# EAGLE schematic cc1200layout (EAGLE 6.4)
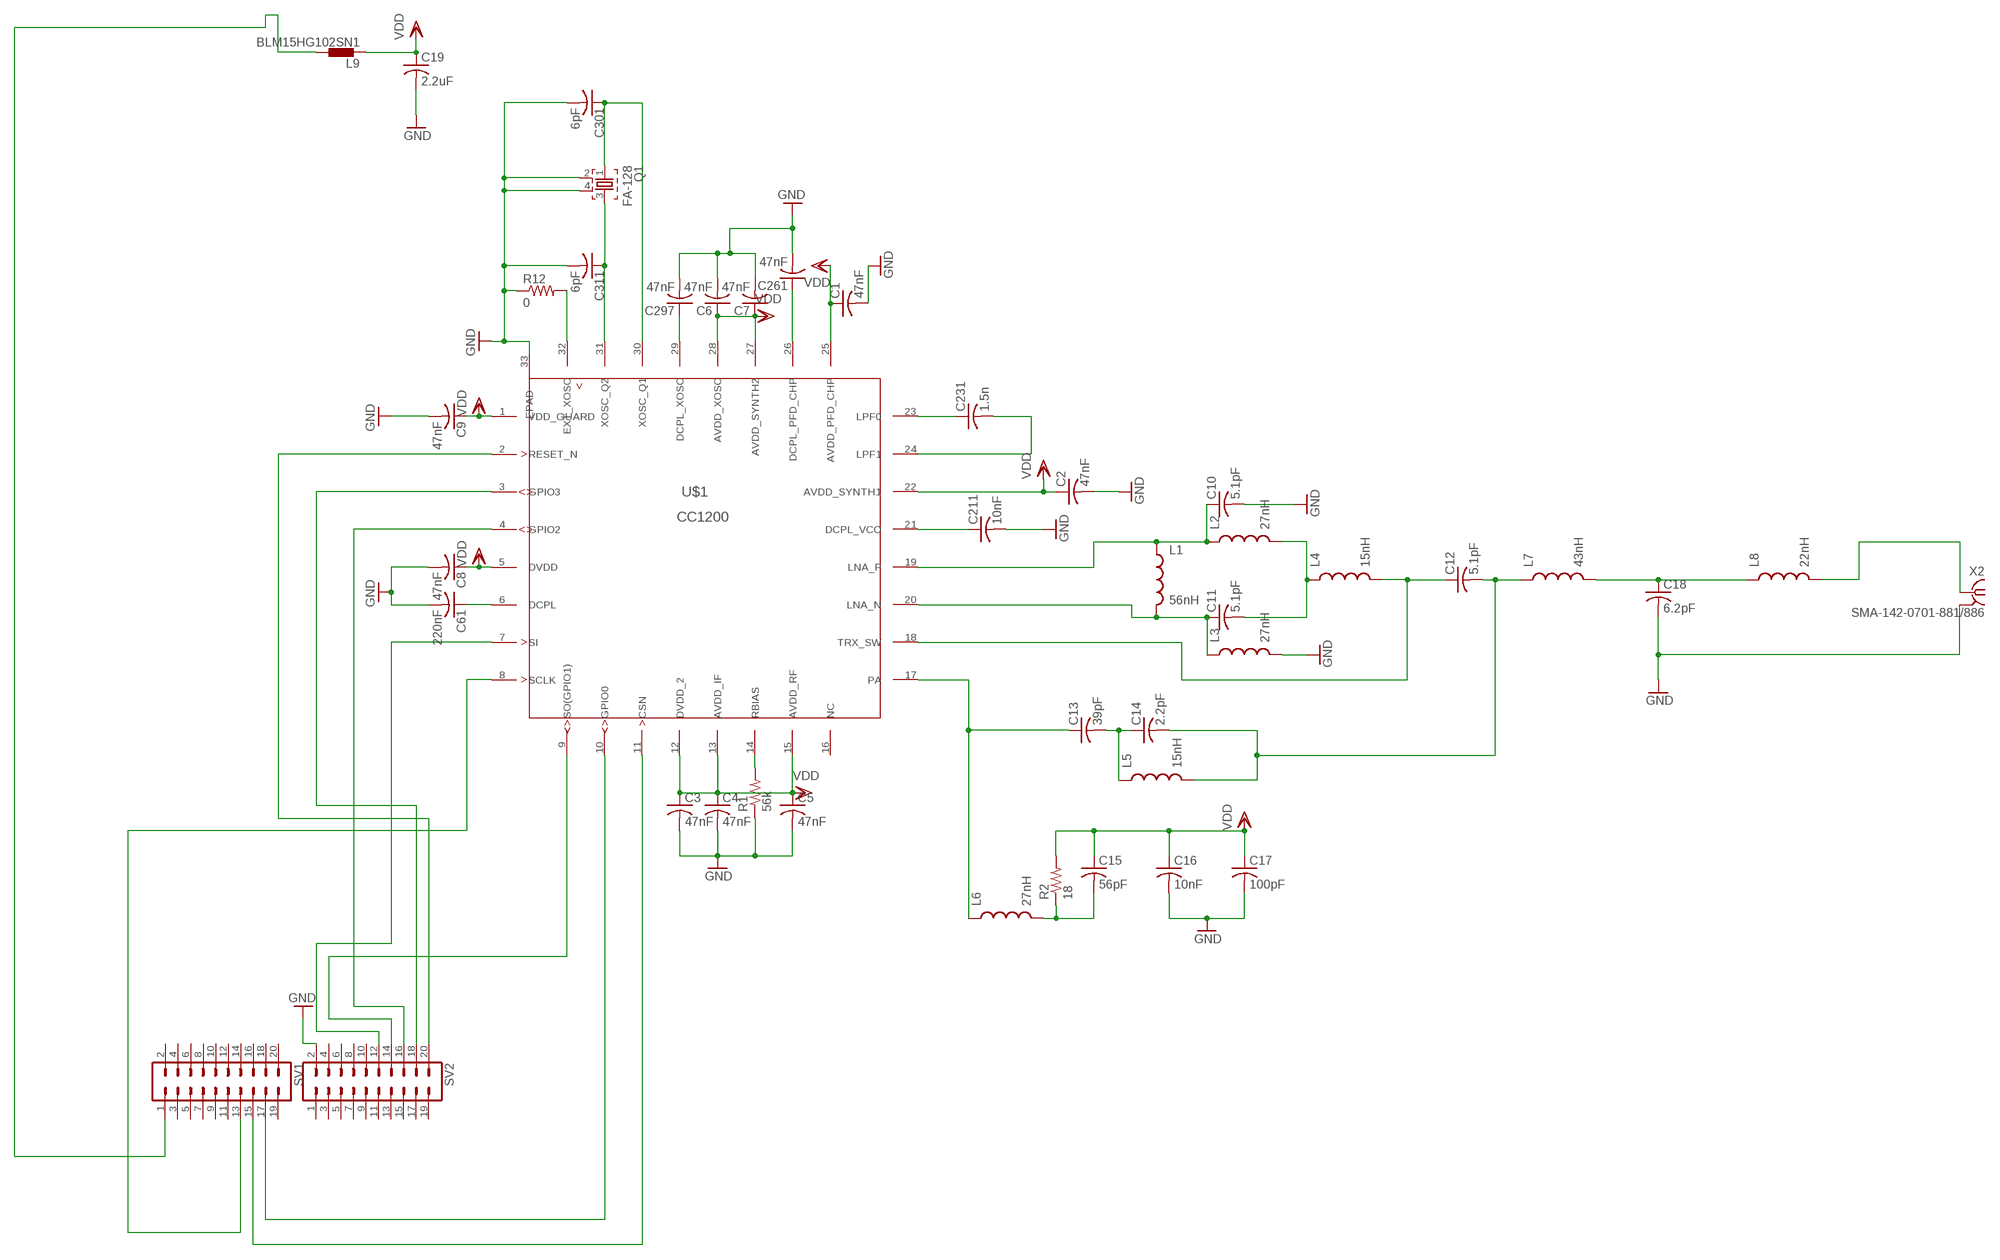
[diagram p0: schematic, sheet 1]

## Parts
C1  47nF  C-USC0402K  [C0402K]
C2  47nF  C-USC0402K  [C0402K]
C3  47nF  C-USC0402K  [C0402K]
C4  47nF  C-USC0402K  [C0402K]
C5  47nF  C-USC0402K  [C0402K]
C6  47nF  C-USC0402K  [C0402K]
C7  47nF  C-USC0402K  [C0402K]
C8  47nF  C-USC0402K  [C0402K]
C9  47nF  C-USC0402K  [C0402K]
C10  5.1pF  C-USC0402K  [C0402K]
C11  5.1pF  C-USC0402K  [C0402K]
C12  5.1pF  C-USC0402K  [C0402K]
C13  39pF  C-USC0402K  [C0402K]
C14  2.2pF  C-USC0402K  [C0402K]
C15  56pF  C-USC0402K  [C0402K]
C16  10nF  C-USC0402K  [C0402K]
C17  100pF  C-USC0402K  [C0402K]
C18  6.2pF  C-USC0402K  [C0402K]
C19  2.2uF  C-USC0603K  [C0603K]
C61  220nF  C-USC0402K  [C0402K]
C211  10nF  C-USC0402K  [C0402K]
C231  1.5n  C-USC0402K  [C0402K]
C261  47nF  C-USC0402K  [C0402K]
C297  47nF  C-USC0402K  [C0402K]
C301  6pF  C-USC0402K  [C0402K]
C311  6pF  C-USC0402K  [C0402K]
L1  56nH  INDUCTOR0402  [C0402]
L2  27nH  INDUCTOR0402  [C0402]
L3  27nH  INDUCTOR0402  [C0402]
L4  15nH  INDUCTOR0402  [C0402]
L5  15nH  INDUCTOR0402  [C0402]
L6  27nH  INDUCTOR0402  [C0402]
L7  43nH  INDUCTOR0402  [C0402]
L8  22nH  INDUCTOR0402  [C0402]
L9  BLM15HG102SN1  [0402]
Q1  FA-128  [FA-128]
R1  56k  R-US_R0402  [R0402]
R2  18  R-US_R0402  [R0402]
R12  0  R-US_R0402  [R0402]
SV1  MA10-2  [MA10-2]
SV2  MA10-2  [MA10-2]
U$1  CC1200  [RHB32_3P45X3P45]
X2  SMA-142-0701-881/886  [J502-ND-142-0701-881/886]

## Nets
GND: C1.2 C2.2 C3.2 C4.2 C5.2 C6.2 C7.2 C8.2 C9.2 C10.2 C16.2 C17.2 C18.2 C19.2 C61.2 C211.2 C261.2 C297.2 C301.2 C311.2 L3.2 Q1.2 Q1.4 R1.1 R12.1 SV2.2 U$1.33(EPAD) X2.G@1 X2.G@2 X2.G@3 X2.G@4
N$1: SV2.12 U$1.7(SI)
N$2: SV1.13 U$1.8(SCLK)
N$3: SV2.14 U$1.9(SO(GPIO1))
N$4: SV1.17 U$1.10(GPIO0)
N$5: SV1.15 U$1.11(CSN)
N$6: C231.1 U$1.23(LPF0)
N$7: C231.2 U$1.24(LPF1)
N$8: C211.1 U$1.21(DCPL_VCO)
N$9: C261.1 U$1.26(DCPL_PFD_CHP)
N$10: C297.1 U$1.29(DCPL_XOSC)
N$11: C61.1 U$1.6(DCPL)
N$12: R1.2 U$1.14(RBIAS)
N$13: R12.2 U$1.32(EXT_XOSC)
N$14: C311.1 Q1.3 U$1.31(XOSC_Q2)
N$15: SV2.16 U$1.4(GPIO2)
N$16: SV2.18 U$1.3(GPIO3)
N$17: SV2.20 U$1.2(RESET_N)
N$18: C301.1 Q1.1 U$1.30(XOSC_Q1)
N$19: C10.1 L1.1 L2.1 U$1.19(LNA_P)
N$20: C11.1 L1.2 L3.1 U$1.20(LNA_N)
N$21: L9.2 SV1.1
N$22: C13.1 L6.1 U$1.17(PA)
N$23: C11.2 L2.2 L4.1
N$24: C12.1 L4.2 U$1.18(TRX_SW)
N$25: C13.2 C14.1 L5.1
N$26: C12.2 C14.2 L5.2 L7.1
N$27: C15.2 L6.2 R2.1
N$31: C18.1 L7.2 L8.1
N$32: L8.2 X2.1
VDD: C1.1 C2.1 C3.1 C4.1 C5.1 C6.1 C7.1 C8.1 C9.1 C15.1 C16.1 C17.1 C19.1 L9.1 R2.2 U$1.1(VDD_GUARD) U$1.5(DVDD) U$1.12(DVDD_2) U$1.13(AVDD_IF) U$1.15(AVDD_RF) U$1.22(AVDD_SYNTH1) U$1.25(AVDD_PFD_CHP) U$1.27(AVDD_SYNTH2) U$1.28(AVDD_XOSC)
Unconnected: SV1.2 SV1.3 SV1.4 SV1.5 SV1.6 SV1.7 SV1.8 SV1.9 SV1.10 SV1.11 SV1.12 SV1.14 SV1.16 SV1.18 SV1.19 SV1.20 SV2.1 SV2.3 SV2.4 SV2.5 SV2.6 SV2.7 SV2.8 SV2.9 SV2.10 SV2.11 SV2.13 SV2.15 SV2.17 SV2.19 U$1.16(NC)

## Library data of the parts
C1-C19 C61 C211 C231 C261 C297 C301 C311 = resistor:C-US: CAPACITOR, American symbol
L1-L8 = SparkFun-Passives:INDUCTOR: Inductors Basic Inductor/Choke - 0603 and 1206. Footprints are not proven and vary greatly between part numbers. SRN6045- 33uH, 20% 1.4A SDR0403-560KL - 56uH, 10%, 500mA RMS/740mA peak
L9 = inductors:BLM15H: EMIFIL (R) Chip Ferrite Bead for GHz Noise Source: http://www.murata.com/ Ferrite Bead BLM15H.pdf
Q1 = crystal:FA-: MHz RANGE CRYSTAL UNIT Source: Epson Toyocom
R1 R2 R12 = resistor:R-US_: RESISTOR, American symbol
SV1 SV2 = con-lstb:MA10-2: PIN HEADER; OC_FARNELL: unknown; OC_NEWARK: unknown
U$1 = cc1200:CC1200
X2 = con-coax:SMA-: SMA 50 Ohm End Launch Jack Receptacle - Round Contact Johnson Components Source: www.johnsoncomponents.com .. J502-ND.pdf; MF: JOHNSON COMPONENTS; MPN: 142-0701-881; OC_FARNELL: 1608603; OC_NEWARK: 08B906

## Net classes
0 default: width 0.152 mm, drill 0.33 mm, clearance 0.152 mm